# EAGLE design SPIBreakout (EAGLE 7.1.0)
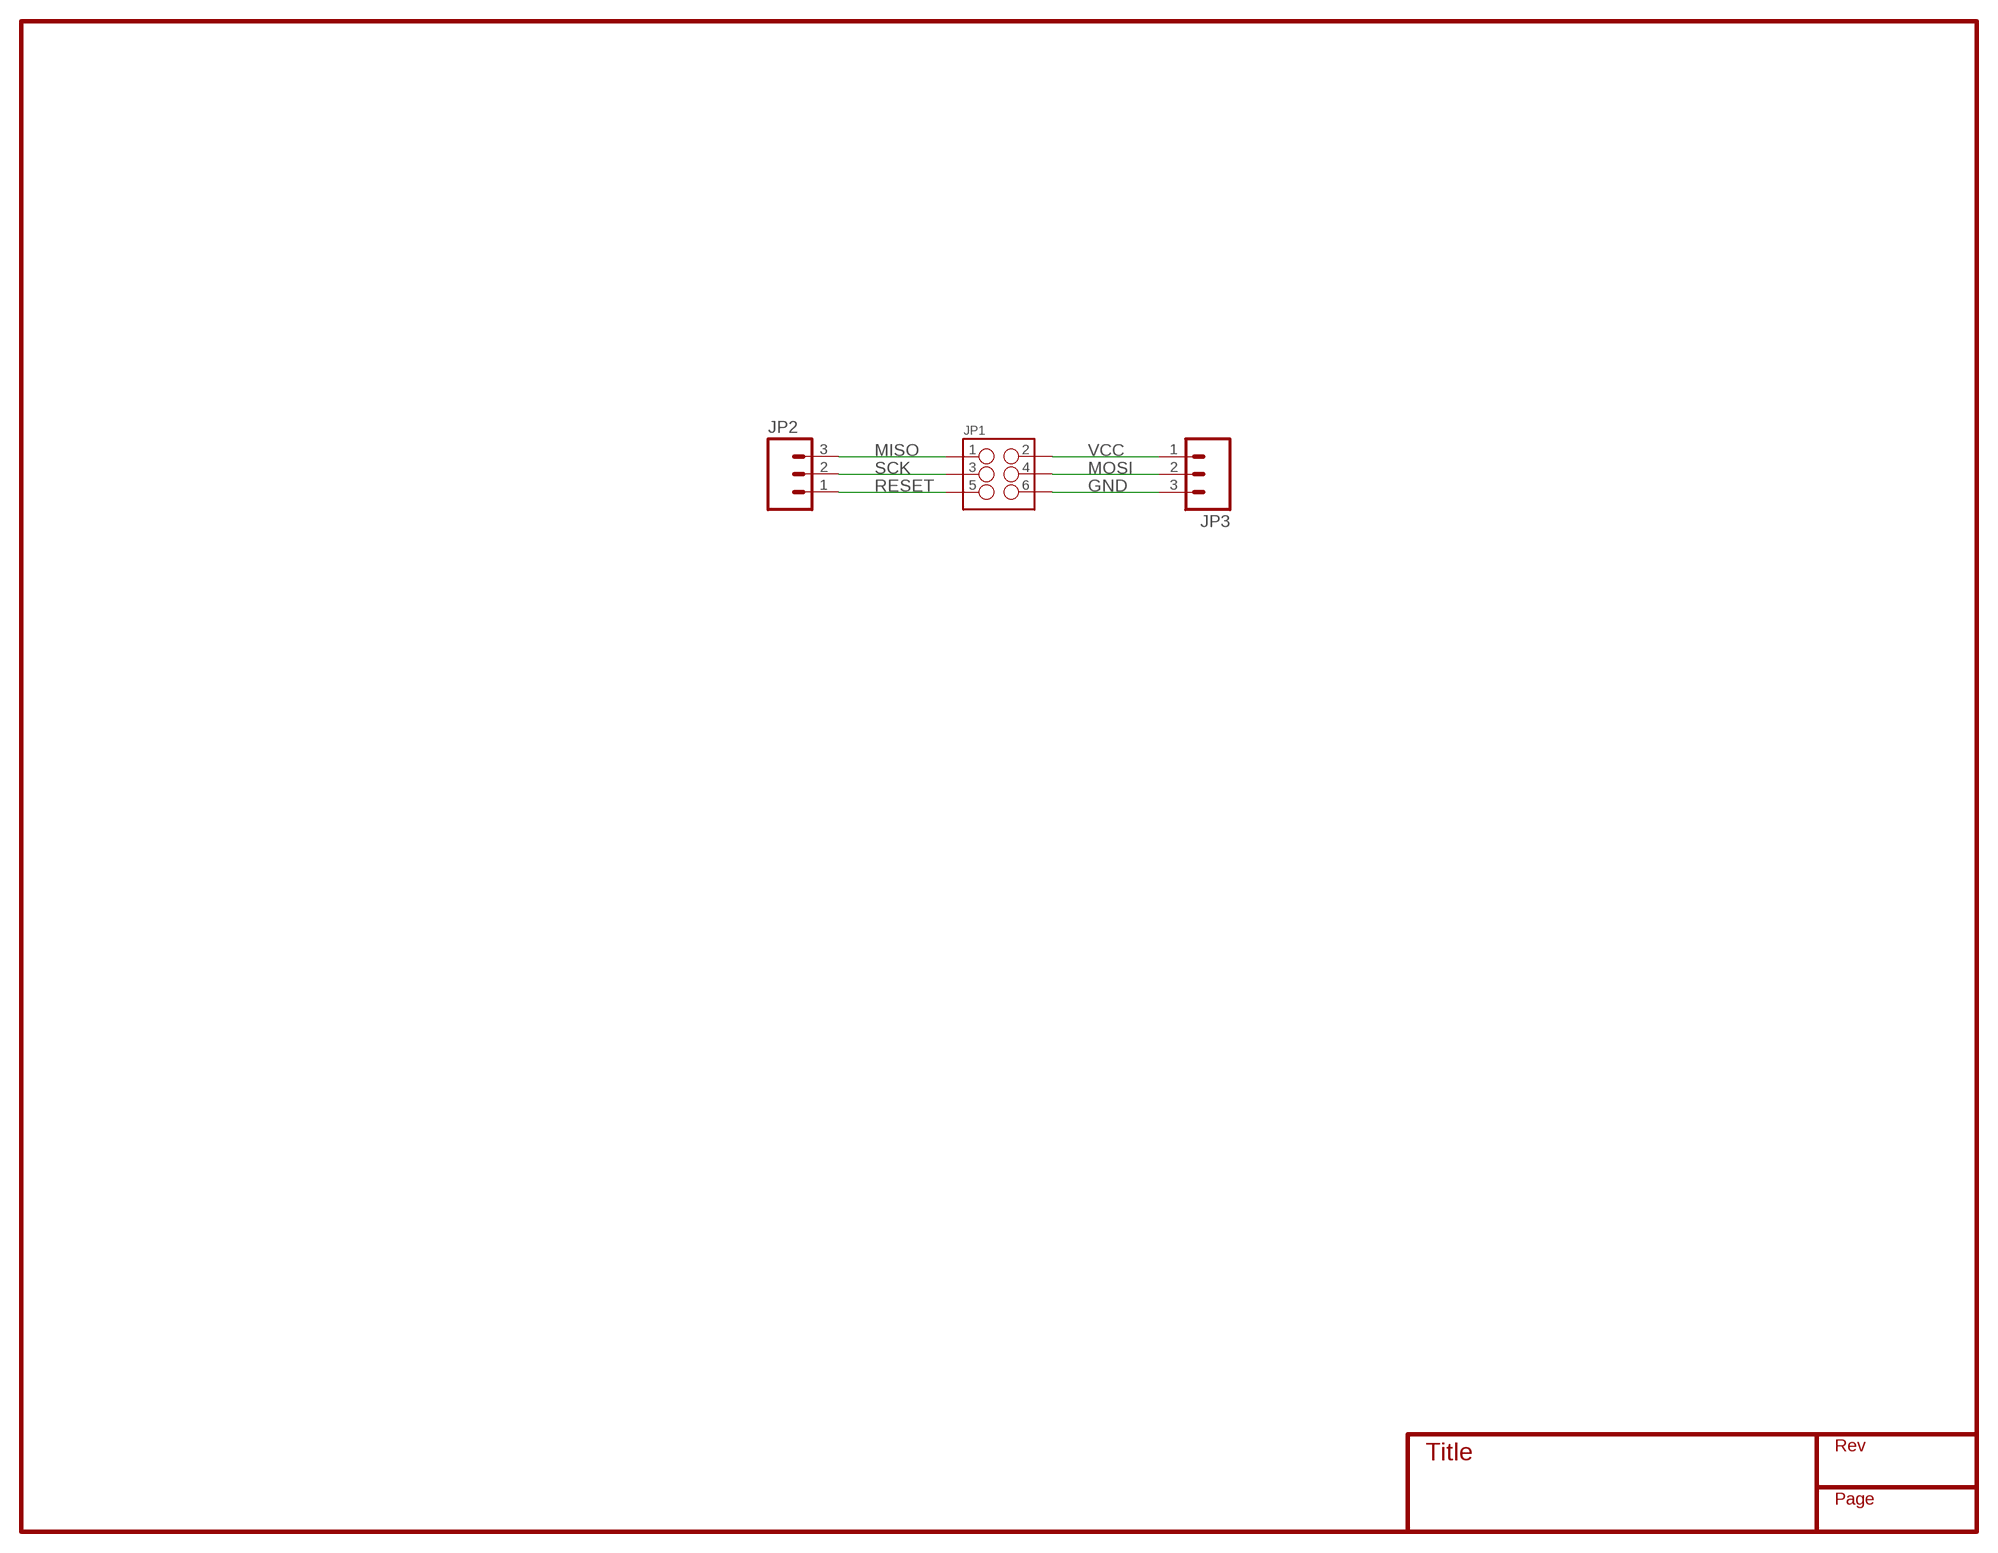
[diagram p0: schematic, sheet 1]

## Parts
JP1  M03X2FEMALE  [2X3]
JP2  M03PTH  [1X03]
JP3  M03PTH  [1X03]

## Nets
GND: JP1.6 JP3.3
MISO: JP1.1 JP2.3
MOSI: JP1.4 JP3.2
RESET: JP1.5 JP2.1
SCK: JP1.3 JP2.2
VCC: JP1.2 JP3.1

## Library data of the parts
JP1 = SparkFun-Connectors:M03X2: 2x3 .1" header. Shrouded, with keying- CONN-10681 SMT- CONN-11415 Pogo pins- HW-11044; PROD_ID: CONN-11566; VALUE: FEMALE 2x3
JP2 JP3 = SparkFun-Connectors:M03: Header 3 Standard 3-pin 0.1" header. Use with straight break away headers (SKU : PRT-00116), right angle break away headers (PRT-00553), swiss pins (PRT-00743), machine pins (PRT-00117), and female headers (PRT-00115). Molex polarized connector foot print use with SKU : PRT-08232 with associated crimp pins and housings.

## Board
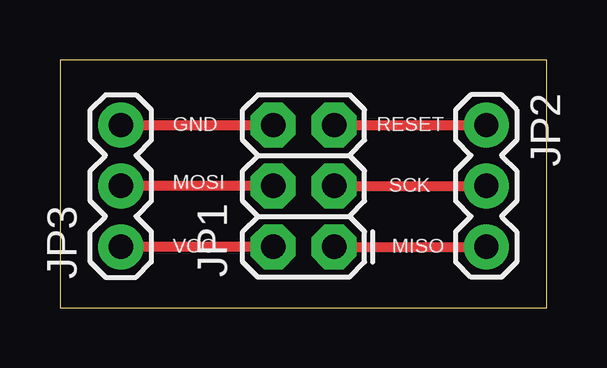
[diagram p1: board, top side]

Size 20.3 x 10.34 mm. Coordinates in mm from the lower left corner, seen from the top.
Outline: 0,0 20.3,0 20.3,10.34 0,10.34 0,0
Copper layers (1*16): Top 0.035mm / dielectric 1.5mm / Bottom 0.035mm
Design rules "default": minimum track width 10mil, minimum drill 24mil, track to track 8mil, track to pad 8mil, pad to pad 8mil, via to via 8mil, smd to smd 8mil, copper to edge 40mil, drill to drill 8mil, minimum pad ring 10mil, minimum via ring 8mil, stop-mask expansion 4mil, vias tented up to drill 0mil, thermal gap 10mil

### Footprints (pad centres in the part's own frame; a part is rotated, then mirrored left to right if it is on the bottom)
2X3 = drill 1.016 pad 1.88 octagon: 1 0,0; 2 0,2.54; 3 2.54,0; 4 2.54,2.54; 5 5.08,0; 6 5.08,2.54
1X03 = drill 1.016 pad 1.88: 1 0,0; 2 2.54,0; 3 5.08,0

### Placement (x,y rotation side)
JP1  11.43,2.54 90 top
JP2  17.78,7.62 270 top
JP3  2.54,2.54 90 top

### Tracks (layer width: path | path; a pad name or v marks a point on that pad's centre or on a via)
GND
  Top 0.406: JP3.3 JP1.6
MISO
  Top 0.406: JP1.1 JP2.3
MOSI
  Top 0.406: JP1.4 JP3.2
RESET
  Top 0.406: JP1.5 JP2.1
SCK
  Top 0.406: JP1.3 JP2.2
VCC
  Top 0.406: JP1.2 JP3.1

### Text on the board
tPlace: GND | RESET | MOSI | SCK | VCC | MISO